# Altium schematic sheet 3_classyTKL_EC_mcu.SchDoc: =ProjectTitle
size A4; Address1: github.com/4pplet/yakiimo-pcb; Address2: Licence:; SheetNumber: 3; SheetTotal: 3
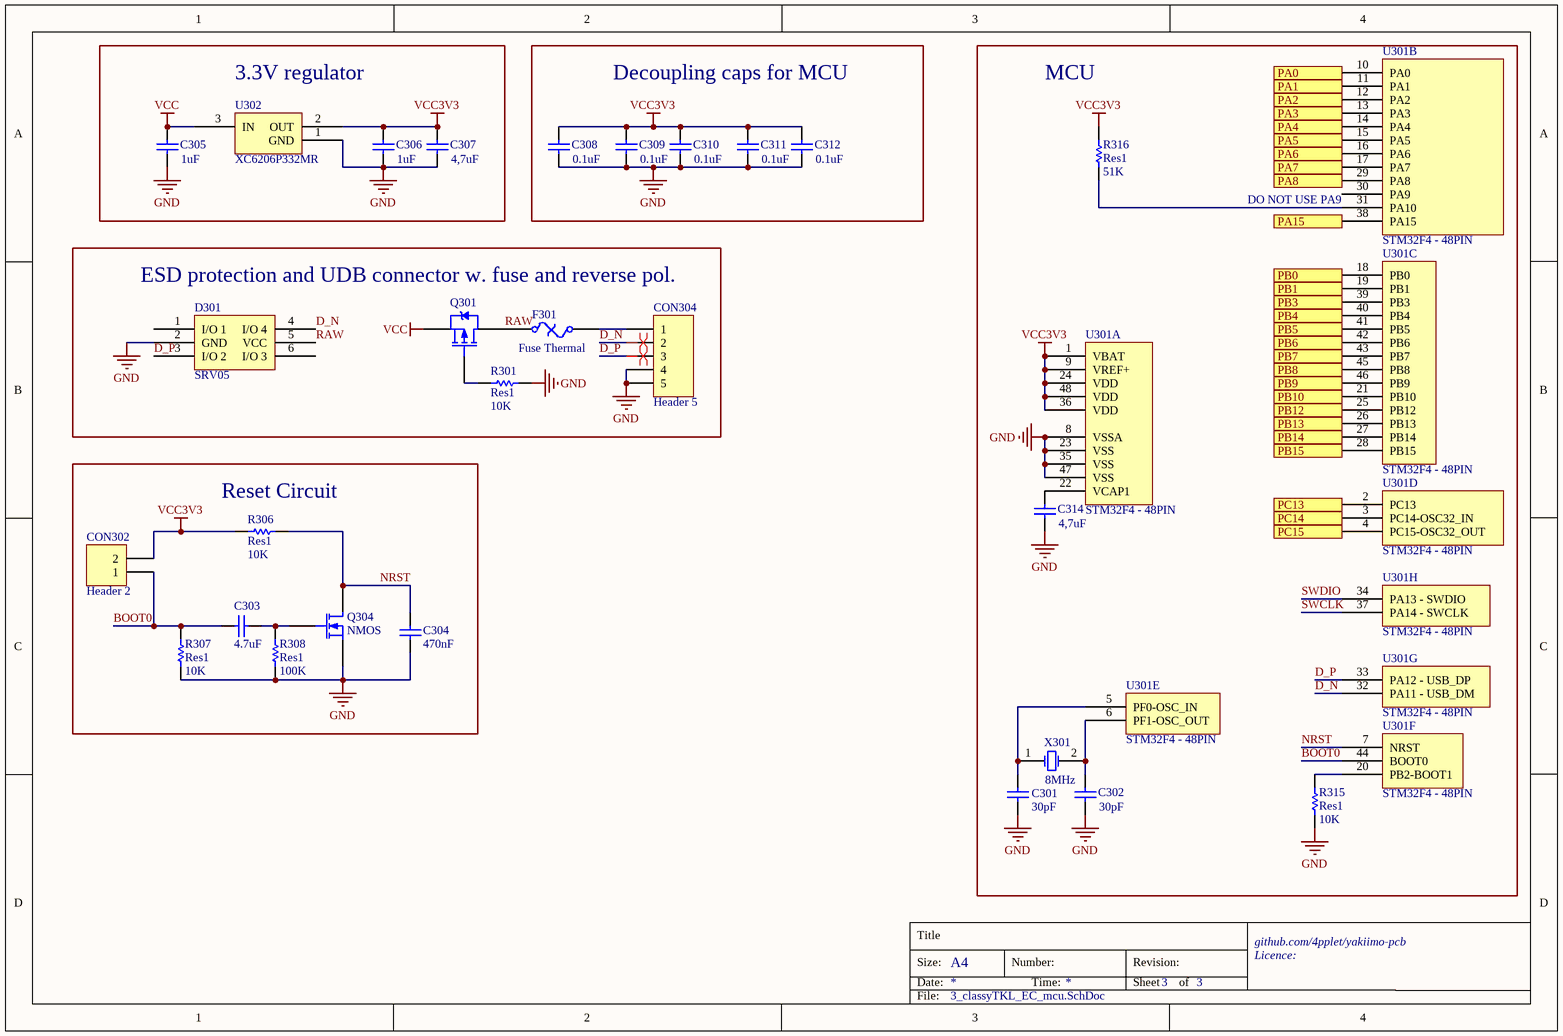
[diagram p0: 3_classyTKL_EC_mcu.SchDoc]

## Parts
C301  value 30pF  [C0603[1608]]
C302  value 30pF  [C0603[1608]]
C303  value 4.7uF  [C0603[1608]]
C304  value 470nF  [C0603[1608]]
C305  value 1uF  [C0603[1608]]
C306  value 1uF  [C0603[1608]]
C307  value 4,7uF  [C0603[1608]]
C308  value 0.1uF  [C0603[1608]]
C309  value 0.1uF  [C0603[1608]]
C310  value 0.1uF  [C0603[1608]]
C311  value 0.1uF  [C0603[1608]]
C312  value 0.1uF  [C0603[1608]]
C314  value 4,7uF  [C0603[1608]]
CON302  Header 2  [HDR1X2]  (no BOM)
CON304  Header 5  [JST SM04B-SRSS-TB]
D301  SRV05  [SOT-23-6]
F301  Fuse Thermal  [C1206[3216]]
Q301  PMOS-2  [SOT-23-3]  (value not drawn)
Q304  NMOS  [SOT-23-3]
R301  Res1  value 10K  [R0603[1608]]
R306  Res1  value 10K  [R0603[1608]]
R307  Res1  value 10K  [R0603[1608]]
R308  Res1  value 100K  [R0603[1608]]
R315  Res1  value 10K  [R0603[1608]]
R316  Res1  value 51K  [R0603[1608]]
U301  STM32F4 - 48PIN  [STM32 - COMBO 7x7mm]  (parts A,B,C,D,E,F,G,H of 8)
U302  XC6206P332MR  [SOT-23-3]
X301  value 8MHz  [CTS 445-series crystal]  (hidden comment: XTAL)

## Blocks framed on the sheet
3.3V regulator: C305-C307 U302
Decoupling caps for MCU: C308-C312
MCU: C301 C302 C314 R315 R316 U301 X301
ESD protection and UDB connector w. fuse and reverse pol.: CON304 D301 F301 Q301 R301
Reset Circuit: C303 C304 CON302 Q304 R306-R308

## Ports
PA0, PA1, PA2, PA3, PA4, PA5, PA6, PA7, PA8, PA15, PB0, PB1, PB3, PB4, PB5, PB6, PB7, PB8, PB9, PB10, PB12, PB13, PB14, PB15, PC13, PC14, PC15

## Nets
GND: C301.1 C302.1 C304.2 C305.1 C306.1 C307.1 C308.1 C309.1 C310.1 C311.1 C312.1 C314.1 CON304.4 CON304.5 D301.2(GND) Q304.2(S) R301.2 R307.2 R308.2 R315.2 U301.8(VSSA) U301.23(VSS) U301.35(VSS) U301.47(VSS) U302.1(GND)
VCC: C305.2 Q301.2(S) U302.3(IN)
VCC3V3: C306.2 C307.2 C308.2 C309.2 C310.2 C311.2 C312.2 CON302.2 R306.1 R316.1 U301.1(VBAT) U301.9(VREF+) U301.24(VDD) U301.36(VDD) U301.48(VDD) U302.2(OUT)
BOOT0: C303.1 CON302.1 R307.1 U301.44(BOOT0)
D_N: CON304.2 D301.4(I/O_4) U301.32(PA11_-_USB_DM)
D_P: CON304.3 D301.3(I/O_2) U301.33(PA12_-_USB_DP)
NRST: C304.1 Q304.3(D) R306.2 U301.7(NRST)
PA0: U301.10(PA0) ; port PA0
PA1: U301.11(PA1) ; port PA1
PA2: U301.12(PA2) ; port PA2
PA3: U301.13(PA3) ; port PA3
PA4: U301.14(PA4) ; port PA4
PA5: U301.15(PA5) ; port PA5
PA6: U301.16(PA6) ; port PA6
PA7: U301.17(PA7) ; port PA7
PA8: U301.29(PA8) ; port PA8
PA15: U301.38(PA15) ; port PA15
PB0: U301.18(PB0) ; port PB0
PB1: U301.19(PB1) ; port PB1
PB3: U301.39(PB3) ; port PB3
PB4: U301.40(PB4) ; port PB4
PB5: U301.41(PB5) ; port PB5
PB6: U301.42(PB6) ; port PB6
PB7: U301.43(PB7) ; port PB7
PB8: U301.45(PB8) ; port PB8
PB9: U301.46(PB9) ; port PB9
PB10: U301.21(PB10) ; port PB10
PB12: U301.25(PB12) ; port PB12
PB13: U301.26(PB13) ; port PB13
PB14: U301.27(PB14) ; port PB14
PB15: U301.28(PB15) ; port PB15
PC13: U301.2(PC13) ; port PC13
PC14: U301.3(PC14-OSC32_IN) ; port PC14
PC15: U301.4(PC15-OSC32_OUT) ; port PC15
RAW: D301.5(VCC) F301.1 Q301.3(D)
SWCLK: U301.37(PA14_-_SWCLK)
SWDIO: U301.34(PA13_-_SWDIO)
NetC301_2: C301.2 U301.5(PF0-OSC_IN) X301.1(OSC1)
NetC302_2: C302.2 U301.6(PF1-OSC_OUT) X301.2(OSC2)
NetC303_2: C303.2 Q304.1(G) R308.1
NetC314_2: C314.2 U301.22(VCAP1)
NetCON304_1: CON304.1 F301.2
NetQ301_1: Q301.1(G) R301.1
NetR315_1: R315.1 U301.20(PB2-BOOT1)
NetR316_2: R316.2 U301.31(PA10)

Not connected (* = marked no-connect by the designer): D301 1(I/O_1) 6(I/O_3); U301 30(PA9)

## Layout directives
differential pair: D_N, D_P

## Notes on the sheet
- (near U301) DO NOT USE PA9
- Title
- Size:
- Date:
- A4
- Number:
- Time:
- Revision:
- Sheet
- of
- File:

## Library data of the parts
C301 C302 = Cap: Capacitor; MRF.Part: CL10C300JB8NNNC; LCSC MFG: Samsung Electro-Mechanics; Version: 0603 imperial; LCSC Part #: C22397
C303 C307 C314 = Cap: Capacitor; MRF.Part: CL10A475KO8NNNC; LCSC MFG: Samsung Electro-Mechanics; Version: 0603 imperial; LCSC Part #: C19666
C304 C308-C312 = Cap: Capacitor; MRF.Part: CC0603KRX7R9BB104; LCSC MFG: YAGEO; Version: 0603 imperial; LCSC Part #: C14663
C305 C306 = Cap: Capacitor; MRF.Part: CL10A105KB8NNNC; LCSC MFG: Samsung Electro-Mechanics; Version: 0603 imperial; LCSC Part #: C15849
CON302 = Header 2: Header, 2-Pin; LCSC MFG: DNP; Value: DNP
CON304 = Header 5: JST for USB daughter board; MRF.Part: SM04B-SRSS-TB(LF)(SN); LCSC MFG: JST Sales America; LCSC Part #: C160404
D301 = SRV05: MRF.Part: SRV05-4-P-T7; LCSC MFG: ProTek Devices; LCSC Part #: C85364
F301 = Fuse Thermal: Thermal Fuse; MRF.Part: ASMD1206-050; LCSC MFG: Shenzhen JDT Fuse; LCSC Part #: C135338
Q301 = PMOS-2: P-Channel Power MOSFET; MRF.Part: SI2301CDS-T1-GE3; LCSC MFG: Vishay Intertech; LCSC Part #: C10487; Version: SOT23-3
Q304 = MOSFET-N: N-Channel MOSFET; MRF.Part: 2N7002; LCSC MFG: Changjiang Electronics Tech (CJ); LCSC Part #: C8545
R301 R306 R307 R315 = Res1: Resistor; MRF.Part: 0603WAF1002T5E; LCSC MFG: Uniroyal Elec; Version: 0603 imperial; LCSC Part #: C25804
R308 = Res1: Resistor; MRF.Part: 0603WAF1003T5E; LCSC MFG: Uniroyal Elec; Version: 0603 imperial; LCSC Part #: C25803
R316 = Res1: Resistor; MRF.Part: 0603WAF5102T5E; LCSC MFG: UNI-ROYAL(Uniroyal Elec); Version: 0603 imperial; LCSC Part #: C23196
U301 = STM32F4 - 48PIN: MRF.Part: STM32F411CEU6; LCSC MFG: STMicroelectronics; LCSC Part #: C60420
U302 = SOT23 LDO: LCSC MFG: Torex Semicon; LCSC Part #: C5446; MRF.Part: XC6206P332MR
X301 = XTAL: Crystal Oscillator; MRF.Part: X50328MSB2GI; LCSC MFG: Yangxing Tech; Version: SMD-5032_2P; LCSC Part #: C115962